# EAGLE design Pro-Micro-v11 (EAGLE 5.10)
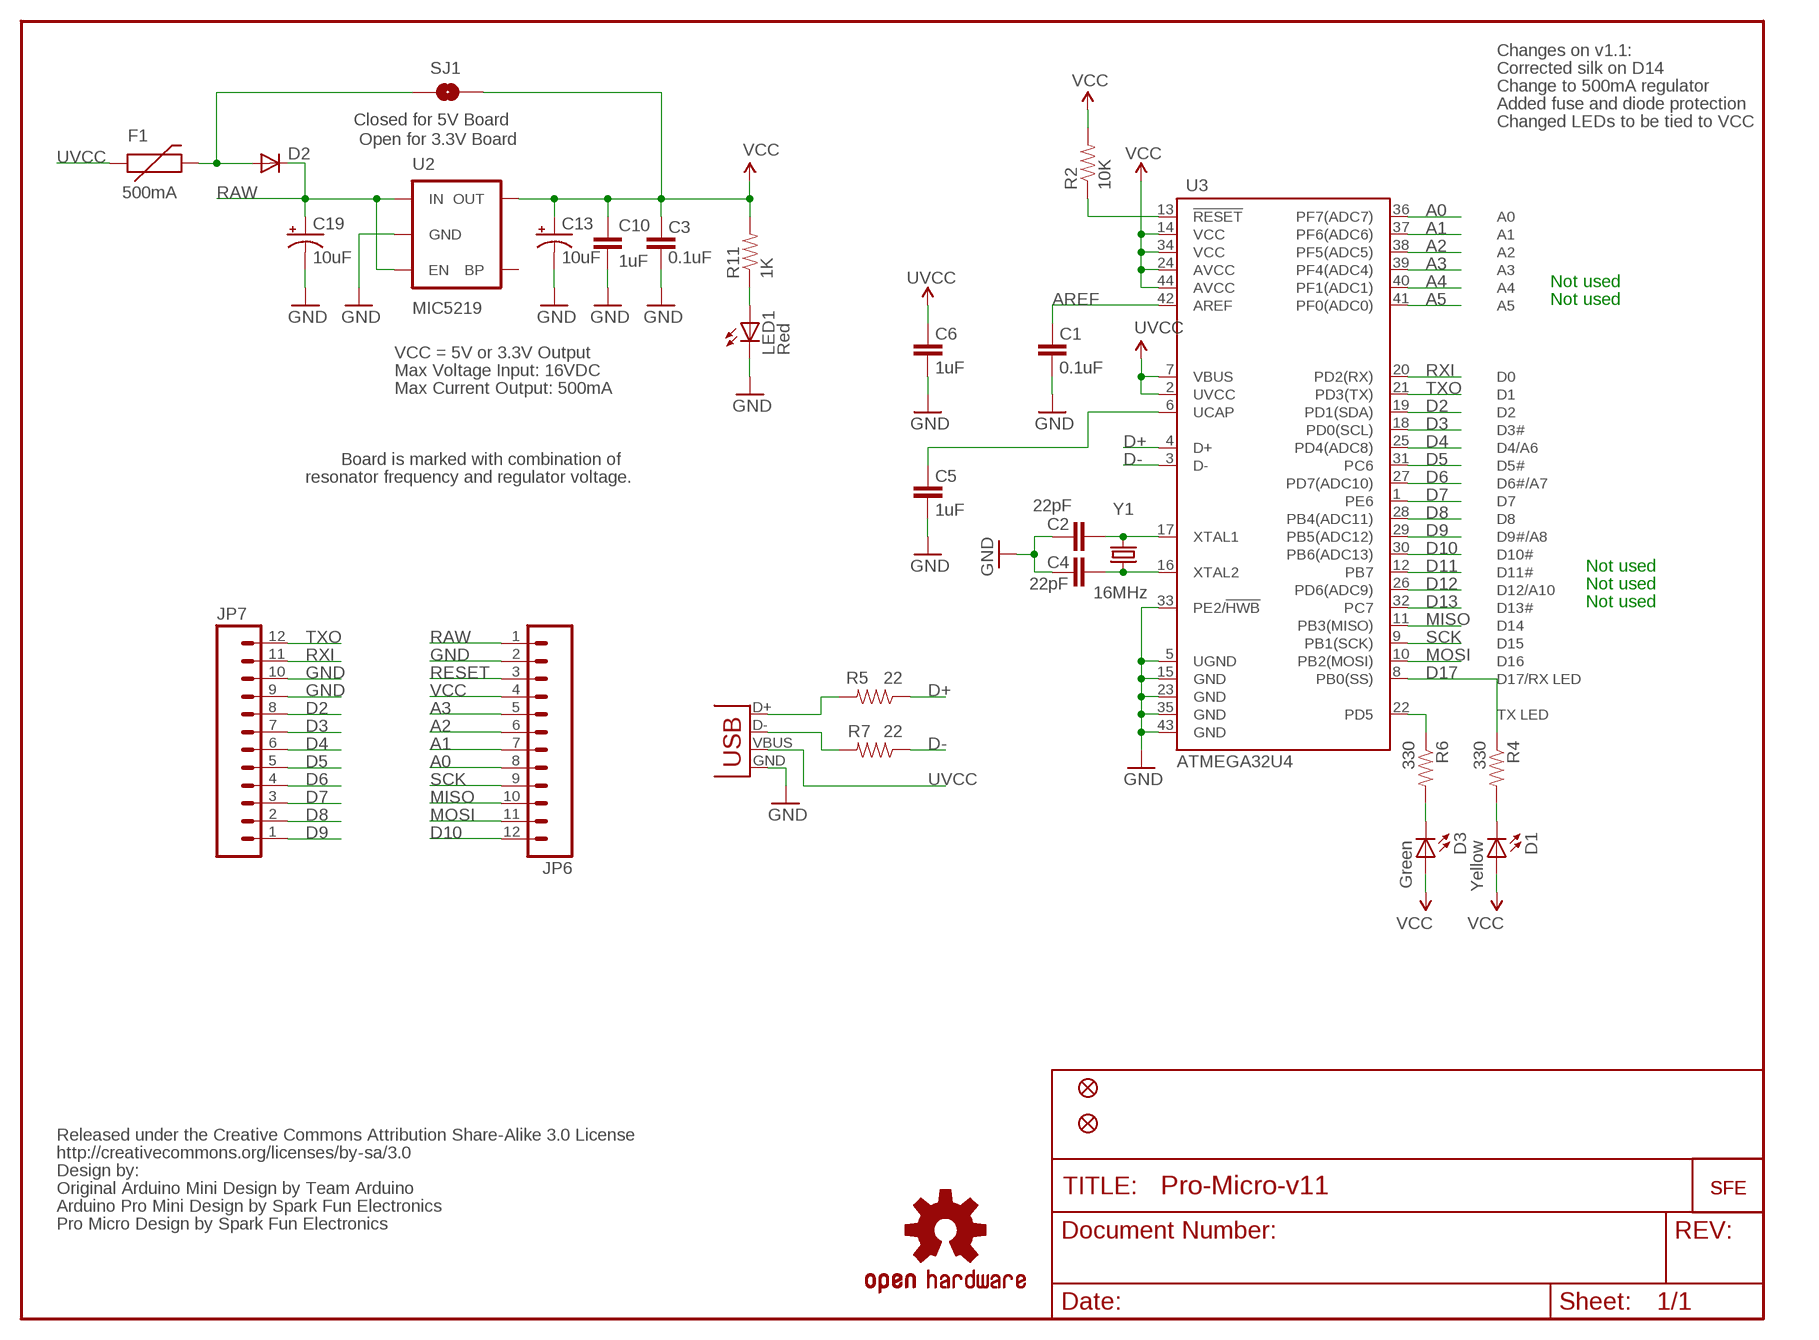
[diagram p0: schematic, sheet 1]

## Parts
C1  0.1uF  CAP0402-CAP  [0402-CAP]
C2  22pF  CAP0402-CAP  [0402-CAP]
C3  0.1uF  CAP0402-CAP  [0402-CAP]
C4  22pF  CAP0402-CAP  [0402-CAP]
C5  1uF  CAP0402-CAP  [0402-CAP]
C6  1uF  CAP0402-CAP  [0402-CAP]
C10  1uF  CAP0402-CAP  [0402-CAP]
C13  10uF  CAP_POL1206  [EIA3216]
C19  10uF  CAP_POL1206  [EIA3216]
D1  Yellow  LED0603  [LED-0603]
D2  DIODESOD  [SOD-323]
D3  Green  LED0603  [LED-0603]
F1  500mA  PTCSMD  [PTC-1206]
JP1  FIDUCIALUFIDUCIAL  [MICRO-FIDUCIAL]
JP2  FIDUCIALUFIDUCIAL  [MICRO-FIDUCIAL]
JP6  M12PTH  [1X12]
JP7  M12PTH  [1X12]
LED1  Red  LED0603  [LED-0603]
R2  10K  RESISTOR0402-RES  [0402-RES]
R4  330  RESISTOR0402-RES  [0402-RES]
R5  22  RESISTOR0402-RES  [0402-RES]
R6  330  RESISTOR0402-RES  [0402-RES]
R7  22  RESISTOR0402-RES  [0402-RES]
R11  1K  RESISTOR0402-RES  [0402-RES]
SJ1  Closed for 5V Board  SOLDERJUMPERNC  [SJ_2S]
U2  MIC5219  V_REG_LDOSMD  [SOT23-5]
U3  ATMEGA32U4  ATMEGA32U4QFN2  [QFN-44-NOPAD]
U$1  LOGO-SFESK  [SFE-LOGO-FLAME]
U$3  OSHW-LOGOS  [OSHW-LOGO-S]
U$5  CREATIVE_COMMONS  [CREATIVE_COMMONS]
U$11  LOGO-SFENEW  [SFE-NEW-WEBLOGO]
X1  USB-MICROB  [USB-MICROB]
Y1  16MHz  CRYSTAL5X3  [CRYSTAL-SMD-5X3]

## Nets
A0: JP6.8 U3.36(PF7(ADC7))
A1: JP6.7 U3.37(PF6(ADC6))
A2: JP6.6 U3.38(PF5(ADC5))
A3: JP6.5 U3.39(PF4(ADC4))
A4: U3.40(PF1(ADC1))
A5: U3.41(PF0(ADC0))
AREF: C1.2 U3.42(AREF)
D2: JP7.8 U3.19(PD1(SDA))
D3: JP7.7 U3.18(PD0(SCL))
D4: JP7.6 U3.25(PD4(ADC8))
D5: JP7.5 U3.31(PC6)
D6: JP7.4 U3.27(PD7(ADC10))
D7: JP7.3 U3.1(PE6)
D8: JP7.2 U3.28(PB4(ADC11))
D9: JP7.1 U3.29(PB5(ADC12))
D10: JP6.12 U3.30(PB6(ADC13))
D11: U3.12(PB7)
D12: U3.26(PD6(ADC9))
D13: U3.32(PC7)
D17: R4.1 U3.8(PB0(SS))
D+: R5.1 U3.4(D+)
D-: R7.1 U3.3(D-)
GND [vcc]: C1.1 C2.2 C3.1 C4.2 C5.1 C6.1 C10.2 C13.C(-) C19.C(-) JP6.2 JP7.9 JP7.10 LED1.C U2.2(GND) U3.5(UGND) U3.15(GND) U3.23(GND) U3.33(PE2/!HWB) U3.35(GND) U3.43(GND) X1.GND
MISO: JP6.10 U3.11(PB3(MISO))
MOSI: JP6.11 U3.10(PB2(MOSI))
N$1: C4.1 U3.16(XTAL2) Y1.1
N$2: C2.1 U3.17(XTAL1) Y1.3
N$3: D2.2(A) F1.2 SJ1.1
N$4: C5.2 U3.6(UCAP)
N$5: D1.C R4.2
N$6: R7.2 X1.D-
N$7: D3.C R6.2
N$8: R5.2 X1.D+
N$38: LED1.A R11.1
RAW [vcc]: C19.A(+) D2.1(C) JP6.1 U2.1(IN) U2.3(EN)
RESET: JP6.3 R2.1 U3.13(!RESET)
RXI: JP7.11 U3.20(PD2(RX))
SCK: JP6.9 U3.9(PB1(SCK))
TXLED: R6.1 U3.22(PD5)
TXO: JP7.12 U3.21(PD3(TX))
UVCC: C6.2 F1.1 U3.2(UVCC) U3.7(VBUS) X1.VBUS
VCC: C3.2 C10.1 C13.A(+) D1.A D3.A JP6.4 R2.2 R11.2 SJ1.2 U2.5(OUT) U3.14(VCC) U3.24(AVCC) U3.34(VCC) U3.44(AVCC)
Unconnected: U2.4(BP)

## Notes on the sheet
- Changes on v1.1:
- Corrected silk on D14
- Change to 500mA regulator
- Added fuse and diode protection
- Changed LEDs to be tied to VCC
- Open for 3.3V Board
- Not used
- Not used
- VCC = 5V or 3.3V Output
- Max Voltage Input: 16VDC
- Max Current Output: 500mA
- Board is marked with combination of
- resonator frequency and regulator voltage.
- Not used
- Not used
- Not used
- Original Arduino Mini Design by Team Arduino
- Arduino Pro Mini Design by Spark Fun Electronics
- Pro Micro Design by Spark Fun Electronics

## Library data of the parts
C1-C6 C10 = SparkFun:CAP: Capacitor Standard 0603 ceramic capacitor, and 0.1" leaded capacitor.
C13 C19 = SparkFun:CAP_POL: Capacitor Polarized These are standard SMD and PTH capacitors. Normally 10uF, 47uF, and 100uF in electrolytic and tantalum varieties. Always verify the external diameter of the through hole cap, it varies with capacity, voltage, and manufacturer. The EIA devices should be standard.
D1 D3 LED1 = SparkFun:LED: LEDs Standard schematic elements and footprints for 5mm, 3mm, 1206, and 0603 sized LEDs. 5mm - Spark Fun Electronics SKU : COM-00529 (and others)
D2 = SparkFun:DIODE: Diode These are standard reverse protection diodes and small signal diodes. SMA package can handle up to about 1A. SOD-323 can handle about 200mA. What the SOD-323 package when ordering, there are some mfgs out there that are 5-pin packages.
F1 = SparkFun:PTC: Resettable Fuse PTC Resettable Fuse. Spark Fun Electronics SKU : COM-08357
JP1 JP2 = SparkFun:FIDUCIAL: Fiducial Alignment Points Various fiducial points for machine vision alignment.
JP6 JP7 = SparkFun:M12: Header 12 Standard 12-pin 0.1" header. Use with straight break away headers (SKU : PRT-00116), right angle break away headers (PRT-00553), swiss pins (PRT-00743), machine pins (PRT-00117), and female headers (PRT-00115).
R2 R4-R7 R11 = SparkFun:RESISTOR: Resistor Basic schematic elements and footprints for 0603, 1206, and PTH resistors.
SJ1 = SparkFun:SOLDERJUMPER: Solder Jumper Standard SMD solder jumper. Used to automate production. Two varients : Normally Open and Normally Closed are the same, but have different paste layers. NC will have a large amount of paste and should jumper during reflow.
U2 = SparkFun:V_REG_LDO: Voltage Regulator LDO Standard 150mA LDO voltage regulator in SOT-23 layout. Micrel part MIC5205. BP (by-pass) pin is used to lower output noise with 470pF cap.
U3 = SparkFun:ATMEGA32U4
U$1 U$11 = SparkFun:LOGO-SFE: Spark Fun Electronics PCB Logo This is the standard Spark Fun Electronics PCB logo.
U$3 = SparkFun:OSHW-LOGO: Open Source Hardware Logo This logo indicates the piece of hardware it is found on incorporates a OSHW license and/or adheres to the definition of open source hardware found here: http://freedomdefined.org/OSHW
U$5 = SparkFun:CREATIVE_COMMONS
X1 = SparkFun:USB: USB Connectors USB-B-PTH is fully proven SKU : PRT-00139 USB-miniB is fully proven SKU : PRT-00587 USB-A-PCB is untested. USB-A-H is throughly reviewed, but untested. Spark Fun Electronics SKU : PRT-00437 USB-B-SMT is throughly reviewed, but untested. Needs silkscreen touching up. USB-A-S has not been used/tested USB-MB-H has not been used/tested
Y1 = SparkFun:CRYSTAL: Crystals Various standard crystals. Proven footprints. Spark Fun Electronics SKU : COM-00534

## Net classes
0 default: width 0.203 mm

## Board
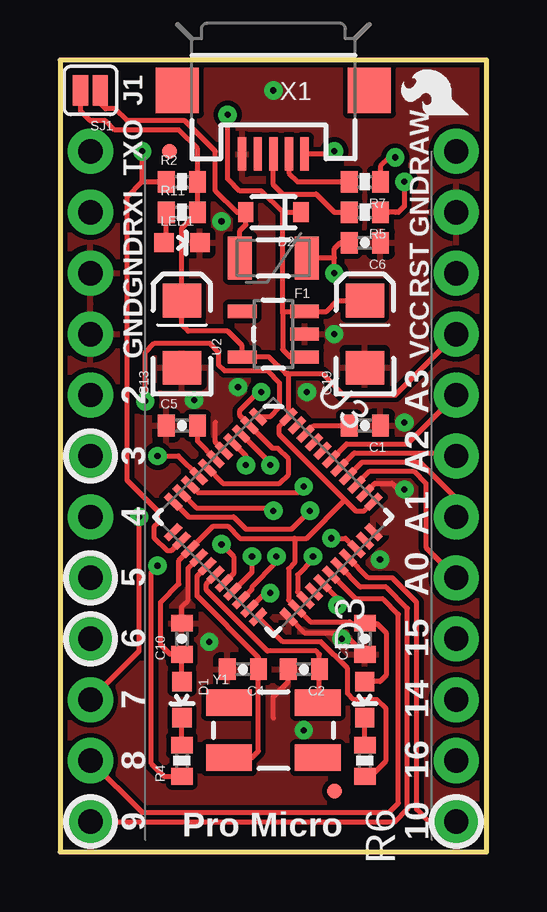
[diagram p1: board, top side]
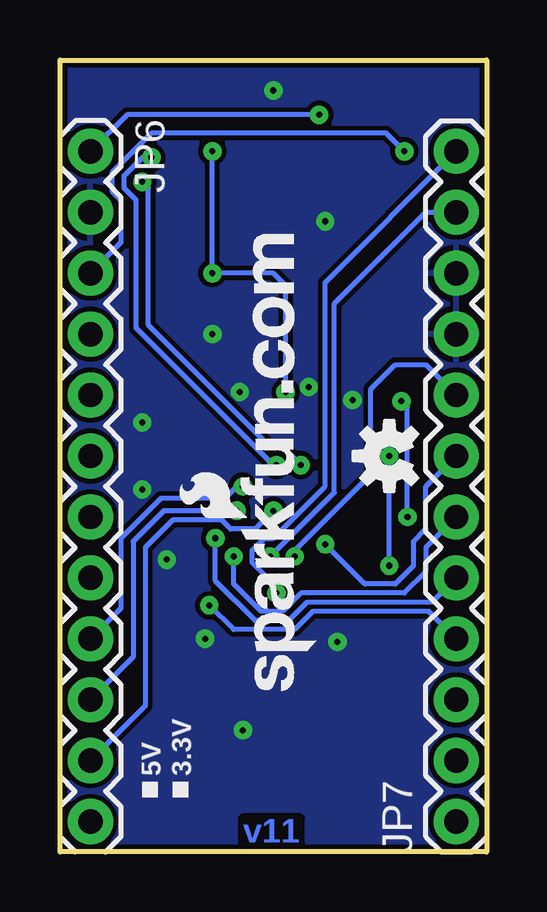
[diagram p2: board, bottom side, seen from below]

Size 17.78 x 33.02 mm. Coordinates in mm from the lower left corner, seen from the top.
Outline: 0,33.02 0,0 17.78,0 17.78,33.02 0,33.02
Copper layers (1*16): Top 0.035mm / dielectric 1.5mm / Bottom 0.035mm
Design rules: minimum track width 8mil, minimum drill 10mil, track to track 7mil, track to pad 7mil, pad to pad 7mil, via to via 8mil, smd to smd 7mil, copper to edge 8mil, drill to drill 8mil, minimum pad ring 12mil, minimum via ring 10mil, stop-mask expansion 4mil, vias tented up to drill 20mil, thermal gap 10mil

### Footprints (pad centres in the part's own frame; a part is rotated, then mirrored left to right if it is on the bottom)
0402-CAP = smd 0.7 x 0.9: 1 -0.65,0; 2 0.65,0
EIA3216 = smd 1.4 x 1.6: A 1.4,0; C -1.4,0
LED-0603 = smd 0.8 x 0.8: A 0,-0.75; C 0,0.75
SOD-323 = smd 0.63 x 0.83: 1 -1.15,0; 2 1.15,0
PTC-1206 = smd 1 x 1.8: 1 -1.4,0; 2 1.4,0
MICRO-FIDUCIAL = smd 0.635 x 0.635: 1 0,0
1X12 = drill 1.016 pad 1.88: 1 0,0; 2 2.54,0; 3 5.08,0; 4 7.62,0; 5 10.16,0; 6 12.7,0; 7 15.24,0; 8 17.78,0; 9 20.32,0; 10 22.86,0; 11 25.4,0; 12 27.94,0
0402-RES = smd 0.7 x 0.9: 1 -0.65,0; 2 0.65,0
SJ_2S = smd 0.635 x 1.27: 1 -0.412,0; 2 0.412,0
SOT23-5 = smd 0.55 x 1.2: 1 -0.95,-1.3; 2 0,-1.3; 3 0.95,-1.3; 4 0.95,1.3; 5 -0.95,1.3
QFN-44-NOPAD = smd 0.8 x 0.3: 1 -3.4,2.5; 2 -3.4,2; 3 -3.4,1.5; 4 -3.4,1; 5 -3.4,0.5; 6 -3.4,0; 7 -3.4,-0.5; 8 -3.4,-1; 9 -3.4,-1.5; 10 -3.4,-2; 11 -3.4,-2.5; 23 3.4,-2.5; 24 3.4,-2; 25 3.4,-1.5; 26 3.4,-1; 27 3.4,-0.5; 28 3.4,0; 29 3.4,0.5; 30 3.4,1; 31 3.4,1.5; 32 3.4,2; 33 3.4,2.5 | smd 0.3 x 0.8: 12 -2.5,-3.4; 13 -2,-3.4; 14 -1.5,-3.4; 15 -1,-3.4; 16 -0.5,-3.4; 17 0,-3.4; 18 0.5,-3.4; 19 1,-3.4; 20 1.5,-3.4; 21 2,-3.4; 22 2.5,-3.4; 34 2.5,3.4; 35 2,3.4; 36 1.5,3.4; 37 1,3.4; 38 0.5,3.4; 39 0,3.4; 40 -0.5,3.4; 41 -1,3.4; 42 -1.5,3.4; 43 -2,3.4; 44 -2.5,3.4
USB-MICROB = smd 0.35 x 1.4: D+ 0,2.65; D- -0.65,2.65; GND 1.3,2.65; ID 0.65,2.65; VBUS -1.3,2.65 | smd 1.8 x 1.9: MT1 -4,0; MT2 4,0
CRYSTAL-SMD-5X3 = smd 1.9 x 1.1: 1 -1.85,-1.15; 2 1.85,-1.15; 3 1.85,1.15; 4 -1.85,1.15

### Placement (x,y rotation side)
C1  12.7,17.78 180 top
C2  10.16,7.62 180 top
C3  12.7,8.89 90 top
C4  7.62,7.62 180 top
C5  5.08,17.78 0 top
C6  12.7,25.4 180 top
C10  5.08,8.89 90 top
C13  5.08,21.59 90 top
C19  12.7,21.59 90 top
D1  5.08,6.35 180 top
D2  8.89,26.67 180 top
D3  12.7,6.35 180 top
F1  8.89,24.77 180 top
JP1  11.43,2.54 0 top
JP2  4.57,29.21 0 top
JP6  16.51,29.21 270 bottom
JP7  1.27,1.27 90 bottom
LED1  5.08,25.4 270 top
R2  5.08,27.94 0 top
R4  5.08,3.81 90 top
R5  12.7,26.67 180 top
R6  12.7,3.81 90 top
R7  12.7,27.94 180 top
R11  5.08,26.67 0 top
SJ1  1.27,31.75 180 top
U2  8.89,21.59 90 top
U3  8.89,13.97 315 top
U$1  17.02,30.73 90 top
U$3  4.06,16.51 90 bottom
U$5  -16.51,-10.16 0 top  (outside the outline)
U$11  7.11,6.73 90 bottom
X1  8.89,31.75 180 top
Y1  8.89,5.08 0 top

### Tracks (layer width: path | path; a pad name or v marks a point on that pad's centre or on a via)
A0
  Top 0.203: JP6.8 15.24,12.7 15.24,15.37 14.73,15.88 12.92,15.88 U3.36
A1
  Top 0.203: U3.37 12.59,16.26 14.99,16.26 16.51,14.73 JP6.7
A2
  Top 0.203: U3.38 12.26,16.64 16.38,16.64 JP6.6
A3
  Top 0.203: U3.39 11.94,17.02 14.48,17.02 JP6.5
AREF
  Top 0.203: U3.42 10.58,17.78 C1.2
D2  (via drill 0.25)
  Top 0.203: U3.19 8,11.67 v8,12.32
  Bottom 0.203: JP7.8 2.54,20.32 3.81,20.32 4.83,19.3 4.83,15.75 8.13,12.45 v8,12.32
D3  (via drill 0.25)
  Top 0.203: v6.73,12.83 7.24,12.32 7.24,11.61 U3.18
  Bottom 0.203: JP7.7 2.54,15.24 2.54,13.46 3.05,12.95 3.05,11.94 3.81,11.18 5.08,11.18 v6.73,12.83
D4  (via drill 0.25)
  Top 0.203: U3.25 9.91,10.83 9.91,11.56 10.54,12.19 v10.54,12.32
  Bottom 0.203: JP7.6 2.54,12.7 2.54,11.68 3.43,10.79 7.75,10.79 8.51,10.03 9.4,10.03 10.54,11.18 v10.54,12.32
D5  (via drill 0.25)
  Top 0.203: U3.31 11.9,13.08 v11.3,13.08
  Bottom 0.203: v11.3,13.08 11.3,11.3 9.65,9.65 8.26,9.65 7.49,10.41 2.29,10.41 JP7.5
D6  (via drill 0.25)
  Top 0.203: U3.27 11.56,10.6 v11.56,10.29
  Bottom 0.203: v11.56,10.29 10.54,9.27 8,9.27 7.24,10.03 2.41,10.03 JP7.4
D7  (via drill 0.25)
  Top 0.203: v3.3,13.97 3.3,8.38 JP7.3 | v3.56,18.8 3.56,20.83 3.94,21.21 6.22,21.21 6.6,20.83 6.6,20.32 6.86,20.07 8.64,20.07 9.14,19.56 9.14,18.54 8.74,18.14 U3.1
  Bottom 0.203: v3.56,18.8 3.3,18.54 v3.3,13.97
D8
  Top 0.203: U3.28 12.32,10.54 13.46,10.54 14.1,9.91 14.1,2.03 13.72,1.65 3.43,1.65 JP7.2
D9
  Top 0.203: U3.29 12.52,11.05 13.59,11.05 14.48,10.16 14.48,1.78 13.97,1.27 JP7.1
D10
  Top 0.203: U3.30 12.84,11.43 13.84,11.43 14.86,10.41 14.86,1.78 15.37,1.27 JP6.12
D17  (via drill 0.25)
  Top 0.203: U3.8 4.94,16.51 v4.06,16.51 | R4.1 4.33,3.16 3.81,3.68 3.81,11.68 v4.06,11.94
  Bottom 0.203: v4.06,11.94 v4.06,16.51
D+  (via drill 0.25)
  Top 0.203: v7.75,16.13 7.75,16.53 U3.4 | v14.35,27.94 14.35,26.92 14.1,26.67 13.97,26.67 13.72,26.67 R5.1
  Bottom 0.203: v7.75,16.13 8.51,16.89 9.02,16.89 14.1,21.97 14.1,27.69 v14.35,27.94
D-  (via drill 0.25)
  Top 0.203: v8.76,16.13 8.76,16.22 U3.3 | R7.1 13.35,28.59 13.72,28.96 v13.97,28.96
  Bottom 0.203: v8.76,16.13 8.89,16.13 14.61,21.84 14.61,27.18 15.11,27.69 15.11,28.19 14.35,28.96 v13.97,28.96
GND  (via drill 0.25)
  Top 0.203: U3.23 10.18,9.14 11.8,9.14 | U3.5 6.48,17.09 6.48,17.91 | U3.35 13.12,15.37 13.84,15.37 14.1,15.11 v14.35,15.11 | U3.15 5.33,11.83 5.33,10.49 5.08,10.24 C10.2 | v6.22,8.76 6.1,8.89 | v11.73,8.89 12.05,8.89 C3.1 | C2.2 9.51,7.1 8.89,6.48 8.89,5.59
  other vias: 10.16,5.08 5.59,18.85 14.35,17.91 11.43,21.59 10.29,19.18 7.42,19.38 8.89,31.75 13.34,12.19 6.73,26.29
  pour Top (isolate 0.203): 0,33.02 17.78,33.02 17.78,0 0,0
  pour Bottom (isolate 0.203): 0,33.02 17.78,33.02 17.78,0 0,0
MISO  (via drill 0.25)
  Top 0.203: U3.11 5.35,13.97 7.24,13.97 7.75,13.46 9.65,13.46 v10.41,14.22
  Bottom 0.203: JP6.10 14.73,8.13 14.73,12.95 13.46,14.22 v10.41,14.22
MOSI  (via drill 0.25)
  Top 0.203: U3.10 5.68,14.35 8.76,14.35 v8.89,14.22
  Bottom 0.203: JP6.11 14.22,6.1 14.22,12.7 13.08,13.84 11.05,13.84 10.67,13.46 9.65,13.46 v8.89,14.22
N$1
  Top 0.203: C4.1 8.27,4.21 7.99,3.93 Y1.1 | C4.1 8.27,7.73 | U3.16 5.71,11.5 5.71,10.67 8.27,8.11 C4.1
N$2
  Top 0.203: Y1.3 10.81,6.3 C2.1 10.81,8.24 10.67,8.38 8.64,8.38 6.1,10.92 6.1,11.18 U3.17
N$3
  Top 0.203: F1.2 7.49,25.91 7.74,26.16 D2.2 7.37,26.67 6.48,27.56 6.48,29.21 5.21,30.48 2.79,30.48 2.29,30.99 1.91,30.99 1.68,31.21 SJ1.1
N$4
  Top 0.203: C5.2 5.73,17.13 U3.6
N$5
  Top 0.203: R4.2 D1.C
N$6
  Top 0.203: X1.D- 9.54,28.31 9.91,27.94 R7.2
N$7
  Top 0.203: R6.2 D3.C
N$8
  Top 0.203: X1.D+ 8.89,27.81 9.27,27.43 10.67,27.43 11.43,26.67 R5.2
N$38
  Top 0.203: R11.1 4.43,25.5 LED1.A
RAW  (via drill 0.25)
  Top 0.203: C19.A 11.56,22.99 11.11,22.54 U2.3 9.33,22.54 9.27,22.48 | U2.1 9.59,20.64 9.27,20.95 9.27,22.48 | v6.99,30.73 6.99,28.07 7.49,27.56 8.38,27.56 9.27,26.67 | 9.27,26.67 D2.1 | 9.27,22.48 9.27,26.67
  Bottom 0.203: JP6.1 14.99,30.73 v6.99,30.73
RESET  (via drill 0.25)
  Top 0.203: 3.43,27.94 v3.43,29.21 | U3.13 4.67,12.57 4.45,12.57 3.94,13.08 3.94,13.59 4.06,13.72 4.06,14.22 2.79,15.49 2.79,27.3 3.43,27.94 | 3.43,27.94 R2.1
  Bottom 0.203: JP6.3 15.24,25.4 15.24,27.18 15.62,27.56 15.62,28.32 13.97,29.97 4.19,29.97 v3.43,29.21
RXI  (via drill 0.25)
  Top 0.203: U3.20 8,10.96 8,11.05 9.02,12.06 v9.02,12.32
  Bottom 0.203: JP7.11 2.54,26.67 6.35,22.86 6.35,14.99 v9.02,12.32
SCK  (via drill 0.25)
  Top 0.203: v10.16,15.24 9.91,14.99 5.75,14.99 U3.9
  Bottom 0.203: JP6.9 15.24,10.16 15.24,13.08 13.59,14.73 10.92,14.73 10.41,15.24 v10.16,15.24
TXLED
  Top 0.203: U3.22 9.29,8.76 10.87,8.76 11.99,7.64 11.99,6.6 12.24,6.35 13.21,6.35 13.59,5.97 13.59,3.81 12.94,3.16 R6.1
TXO  (via drill 0.25)
  Top 0.203: U3.21 8.54,10.79 v8.76,10.79
  Bottom 0.203: JP7.12 6.73,23.75 6.73,15.24 8.89,13.08 9.27,13.08 9.78,12.57 9.78,12.06 8.76,11.05 v8.76,10.79
UVCC  (via drill 0.25)
  Top 0.203: U3.7 6.79,15.37 9.14,15.37 9.53,15.75 9.53,16.38 9.08,16.83 8.86,16.83 U3.2 7.49,18.2 7.49,18.41 8.26,19.18 v8.38,19.18 | X1.VBUS 11.32,29.1 v11.43,29.21 | v11.43,24.13 11.43,24.77 | 11.43,24.77 11.43,25.15 11.68,25.4 C6.2 | 11.43,24.77 F1.1
  Bottom 0.203: v11.43,29.21 v11.43,24.13 8.89,24.13 8.38,23.62 v8.38,19.18
VCC
  Top 0.203: U3.34 12.68,14.22 12.32,14.22 11.87,14.67 | 9.78,13.08 7.49,13.08 6.99,13.59 6.39,13.59 U3.14 4.95,12.15 4.95,11.18 4.19,10.41 4.19,8.64 4.59,8.24 C10.1 D1.A | 9.78,13.08 9.78,12.06 9.53,11.81 9.53,10.51 U3.24 10.43,9.6 12.06,9.6 12.14,9.53 12.69,9.53 | 11.87,14.67 9.14,17.4 9.14,17.76 U3.44 9.53,19.94 | 9.78,13.08 10.29,13.08 11.87,14.67 | 9.53,19.94 9.4,19.94 8.7,20.64 U2.5 7.59,21.11 6.99,21.72 5.33,21.72 5.08,21.97 C13.A 5.08,26.02 R11.2 R2.2 5.73,29.32 4.95,30.1 2.29,30.1 1.91,30.48 1.27,30.48 0.86,30.89 SJ1.2 | 9.53,19.94 10.92,19.94 11.81,19.05 13.97,19.05 JP6.4 | 12.69,9.53 C3.2 | 12.69,9.53 13.21,9.53 13.59,9.14 13.59,7.37 13.34,7.11 12.71,7.11 D3.A

### Text on the board
Bottom: v11
tPlace: J1 | TXO | RAW | RXI | GND | GND | RST | GND | VCC | 2 | A3 | 3 | A2 | 4 | A1 | 5 | A0 | 6 | 15 | 7 | 14 | 8 | 16 | 9 | Pro Micro | 10 | N. Seidle
bPlace: 3.3V | 5V
tValues: Valid combinations: | 3.3V Reg / 8MHz | 5V Reg / 16MHz | Mark back accordingly